# Altium project stm32辉光钟.PrjPcb
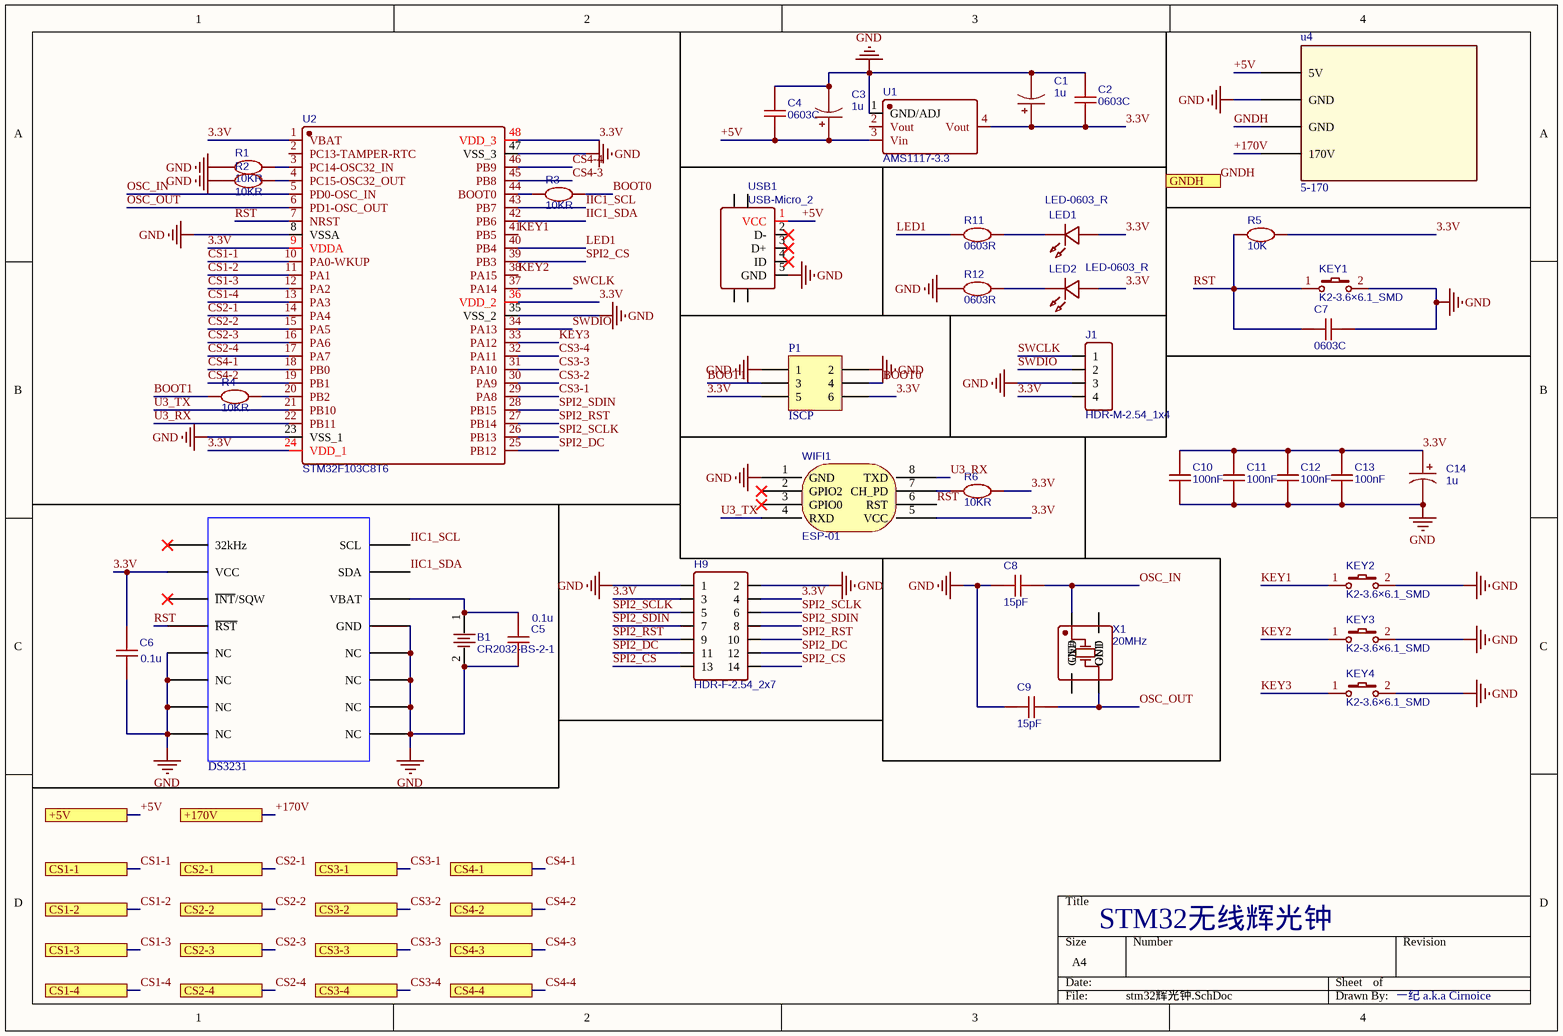
[diagram p0: stm32辉光钟.SchDoc]
2 sheets, 51 parts. Net scope: flat (ports and power ports of the same name join across sheets).
Board file: 辉光钟.PcbDoc
Sheets:
  stm32辉光钟.SchDoc
  辉光管驱动.SchDoc

## Sheet stm32辉光钟.SchDoc
size A4; SheetNumber: 2; SheetTotal: 3

### Parts
B1  CR2032-BS-2-1  [BAT-TH_BS-2-1]
C1  1u  [CASE-A_3216]
C2  0603C  [C0603]
C3  1u  [CASE-A_3216]
C4  0603C  [C0603]
C5  0.1u  [C0603]
C6  0.1u  [C0603]
C7  0603C  [C0603]
C8  15pF  [C0603]
C9  15pF  [C0603]
C10  100nF  [C0603]
C11  100nF  [C0603]
C12  100nF  [C0603]
C13  100nF  [C0603]
C14  1u  [CASE-A_3216]
ds1  DS3231  [DS3231]
H9  HDR-F-2.54_2x7  [HDR-F-2.54_2X7]
J1  HDR-M-2.54_1x4  [HDR-M-2.54_1X4]
KEY1  K2-3.6×6.1_SMD  [KEY-SMD_2P-L6.2-W3.6-LS8.0]
KEY2  K2-3.6×6.1_SMD  [KEY-SMD_2P-L6.2-W3.6-LS8.0]
KEY3  K2-3.6×6.1_SMD  [KEY-SMD_2P-L6.2-W3.6-LS8.0]
KEY4  K2-3.6×6.1_SMD  [KEY-SMD_2P-L6.2-W3.6-LS8.0]
LED1  LED-0603_R  [LED0603_RED]
LED2  LED-0603_R  [LED0603_RED]
P1  ISCP  [HDR2X3]
R1  10KR  [R0603]
R2  10KR  [R0603]
R3  10KR  [R0603]
R4  10KR  [R0603]
R5  10K  [R0603]
R6  10KR  [R0603]
R11  0603R  [R0603]
R12  0603R  [R0603]
U1  AMS1117-3.3  [SOT-223-3_L6.5-W3.4-P2.30-LS7.0-BR]
U2  STM32F103C8T6  [LQFP-48_L7.0-W7.0-P0.50-LS9.0-BL]
u4  5-170  [5-170V]
USB1  USB-Micro_2  [MICRO-USB-SMD_5P_C40957]
WIFI1  ESP-01  [ESP-01]
X1  20MHz  [CRYSTAL-SMD_4P-L3.2-W2.5-BL]

### Ports
+5V, +170V, CS1-1, CS1-2, CS1-3, CS1-4, CS2-1, CS2-2, CS2-3, CS2-4, CS3-1, CS3-2, CS3-3, CS3-4, CS4-1, CS4-2, CS4-3, CS4-4, GNDH

### Nets
GND: B1.2 C1.2 C2.2 C3.2 C4.2 C5.1 C6.1 C7.2 C8.1 C9.1 C10.1 C11.1 C12.1 C13.1 C14.2 ds1.5(NC) ds1.6(NC) ds1.7(NC) ds1.8(NC) ds1.9(NC) ds1.10(NC) ds1.11(NC) ds1.12(NC) ds1.13(GND) H9.1 H9.2 J1.3 KEY1.2 KEY2.2 KEY3.2 KEY4.2 P1.1 P1.2 R1.1 R2.1 R12.1 U1.1(GND/ADJ) U2.8(VSSA) U2.23(VSS_1) U2.35(VSS_2) U2.47(VSS_3) u4.2(GND) USB1.5(GND) WIFI1.1(GND)
3.3V: C1.1 C2.1 C6.2 C10.2 C11.2 C12.2 C13.2 C14.1 ds1.2(VCC) H9.3 H9.4 J1.4 LED1.1 LED2.1 P1.5 P1.6 R5.2 R6.2 U1.4(Vout) U2.1(VBAT) U2.9(VDDA) U2.24(VDD_1) U2.36(VDD_2) U2.48(VDD_3) WIFI1.5(VCC)
+5V: C3.1 C4.1 U1.3(Vin) u4.1(5V) USB1.1(VCC) ; port +5V
+170V: u4.4(170V) ; port +170V
BOOT0: P1.4 R3.2
BOOT1: P1.3 R4.1
CS1-1: U2.10(PA0-WKUP) ; port CS1-1
CS1-2: U2.11(PA1) ; port CS1-2
CS1-3: U2.12(PA2) ; port CS1-3
CS1-4: U2.13(PA3) ; port CS1-4
CS2-1: U2.14(PA4) ; port CS2-1
CS2-2: U2.15(PA5) ; port CS2-2
CS2-3: U2.16(PA6) ; port CS2-3
CS2-4: U2.17(PA7) ; port CS2-4
CS3-1: U2.29(PA8) ; port CS3-1
CS3-2: U2.30(PA9) ; port CS3-2
CS3-3: U2.31(PA10) ; port CS3-3
CS3-4: U2.32(PA11) ; port CS3-4
CS4-1: U2.18(PB0) ; port CS4-1
CS4-2: U2.19(PB1) ; port CS4-2
CS4-3: U2.45(PB8) ; port CS4-3
CS4-4: U2.46(PB9) ; port CS4-4
GNDH: u4.3(GND) ; port GNDH
IIC1_SCL: ds1.16(SCL) U2.43(PB7)
IIC1_SDA: ds1.15(SDA) U2.42(PB6)
KEY1: KEY2.1 U2.41(PB5)
KEY2: KEY3.1 U2.38(PA15)
KEY3: KEY4.1 U2.33(PA12)
LED1: R11.1 U2.40(PB4)
OSC_IN: C8.2 U2.5(PD0-OSC_IN) X1.1(OE#)
OSC_OUT: C9.2 U2.6(PD1-OSC_OUT) X1.3(OUT)
RST: C7.1 ds1.4(~{RST}) KEY1.1 R5.1 U2.7(NRST) WIFI1.6(RST)
SPI2_CS: H9.13 H9.14 U2.39(PB3)
SPI2_DC: H9.11 H9.12 U2.25(PB12)
SPI2_RST: H9.9 H9.10 U2.27(PB14)
SPI2_SCLK: H9.5 H9.6 U2.26(PB13)
SPI2_SDIN: H9.7 H9.8 U2.28(PB15)
SWCLK: J1.1 U2.37(PA14)
SWDIO: J1.2 U2.34(PA13)
U3_RX: U2.22(PB11) WIFI1.8(TXD)
U3_TX: U2.21(PB10) WIFI1.4(RXD)
NetB1_1: B1.1 C5.2 ds1.14(VBAT)
NetLED1_2: LED1.2 R11.2
NetLED2_2: LED2.2 R12.2
NetR1_2: R1.2 U2.3(PC14-OSC32_IN)
NetR2_2: R2.2 U2.4(PC15-OSC32_OUT)
NetR3_1: R3.1 U2.44(BOOT0)
NetR4_2: R4.2 U2.20(PB2)
NetR6_1: R6.1 WIFI1.7(CH_PD)

Not connected (* = marked no-connect by the designer): ds1 1(32kHz)* 3(~{INT}/SQW)*; U1 2(Vout); U2 2(PC13-TAMPER-RTC); USB1 2(D-)* 3(D+)* 4(ID)* 6(SH3) 7(SH4) 8(SH1) 9(SH2); WIFI1 2(GPIO2)* 3(GPIO0)*; X1 2(GND) 4(GND)

### Notes on the sheet
- STM32无线辉光钟
- 一纪 a.k.a Cirnoice

### Library data of the parts
B1 = CR2032-BS-2-1: BOM_Manufacturer: Q&J; BOM_Manufacturer Part: BS-2-1; BOM_Supplier: LCSC; BOM_Supplier Part: C70376; BOM_JLCPCB Part Class: Extended Part; spicePre: B; spiceSymbolName: CR2032-BS-2-1
C1 C3 C14 = 1u: nameAlias: Value(F); Contributor: LCEDA_Lib; spicePre: C; spiceSymbolName: C_Tan_SMD_A_US
C2 C4-C13 = 0603C: nameAlias: Value(F); Contributor: LCEDA_Lib; spicePre: C; spiceSymbolName: C_0603_US
H9 = HDR-F-2.54_2x7: Contributor: LCEDA_Lib; BOM_Supplier Part: C38844; BOM_Supplier: LCSC; spicePre: H; spiceSymbolName: HDR-F-2.54_2x7
J1 = HDR-M-2.54_1x4: Contributor: LCEDA_Lib; BOM_Supplier Part: C124378; BOM_Supplier: LCSC; spicePre: J; spiceSymbolName: HDR-M-2.54_1x4
KEY1-KEY4 = K2-3.6×6.1_SMD: BOM_Manufacturer Part: K2-1107ST-A4SW-06; Contributor: LCEDA_Lib; 制造商: 韩国韩荣; BOM_Supplier Part: C118141; BOM_Supplier: LCSC; spicePre: K; spiceSymbolName: K2-3.6×6.1_SMD
LED1 LED2 = LED-0603_R: BOM_Manufacturer: EVERLIGHT(台湾亿光); BOM_Manufacturer Part: 19-217/R6C-AL1M2VY/3T; Contributor: LCEDA_01; BOM_Supplier Part: C72044; BOM_Supplier: LCSC; spicePre: L; spiceSymbolName: LED-0603_R
P1 = Header 3X2: Header, 3-Pin, Dual row; LatestRevisionDate: 17-Jul-2002; LatestRevisionNote: Re-released for DXP Platform.; Publisher: Altium Limited
R1-R6 R11 R12 = 0603R: nameAlias: Value(Ω); Contributor: LCEDA_Lib; spicePre: R; spiceSymbolName: R_0603_EU
U1 = AMS1117-3.3: BOM_Manufacturer: AMS; sourceId: dwIGgezVh; timeStamp: 1476261164; BOM_Supplier: LCSC; BOM_Manufacturer Part: AMS1117-3.3; BOM_Supplier Part: C6186; BOM_JLCPCB Part Class: Basic Part; spicePre: U; spiceSymbolName: AMS1117-3.3
U2 = STM32F103C8T6: BOM_Manufacturer: STMicroelectronics; timeStamp: 1455028086; BOM_Supplier: LCSC; BOM_Manufacturer Part: STM32F103C8T6; BOM_Supplier Part: C8734; BOM_JLCPCB Part Class: Basic Part; spicePre: U; spiceSymbolName: STM32F103C8T6
USB1 = USB-Micro_2: BOM_Manufacturer: ValuePro; Contributor: LCEDA_Lib; BOM_Supplier Part: C40957; BOM_Supplier: LCSC; spicePre: U; spiceSymbolName: USB-Micro_2
WIFI1 = ESP-01: Contributor: jishuhai; spicePre: w; spiceSymbolName: ESP-01
X1 = 20MHz: BOM_Manufacturer: Zhejiang Abel Elec; BOM_Manufacturer Part: SMD-3225_4P20MHZ20PF10PPM; nameAlias: Frequency; Contributor: LCSC; BOM_Supplier: LCSC; BOM_Supplier Part: C172730; BOM_JLCPCB Part Class: Extended Part; spicePre: X; spiceSymbolName: SMD-3225_4P20MHZ20PF10PPM

## Sheet 辉光管驱动.SchDoc
size A4; SheetNumber: 3; SheetTotal: 3
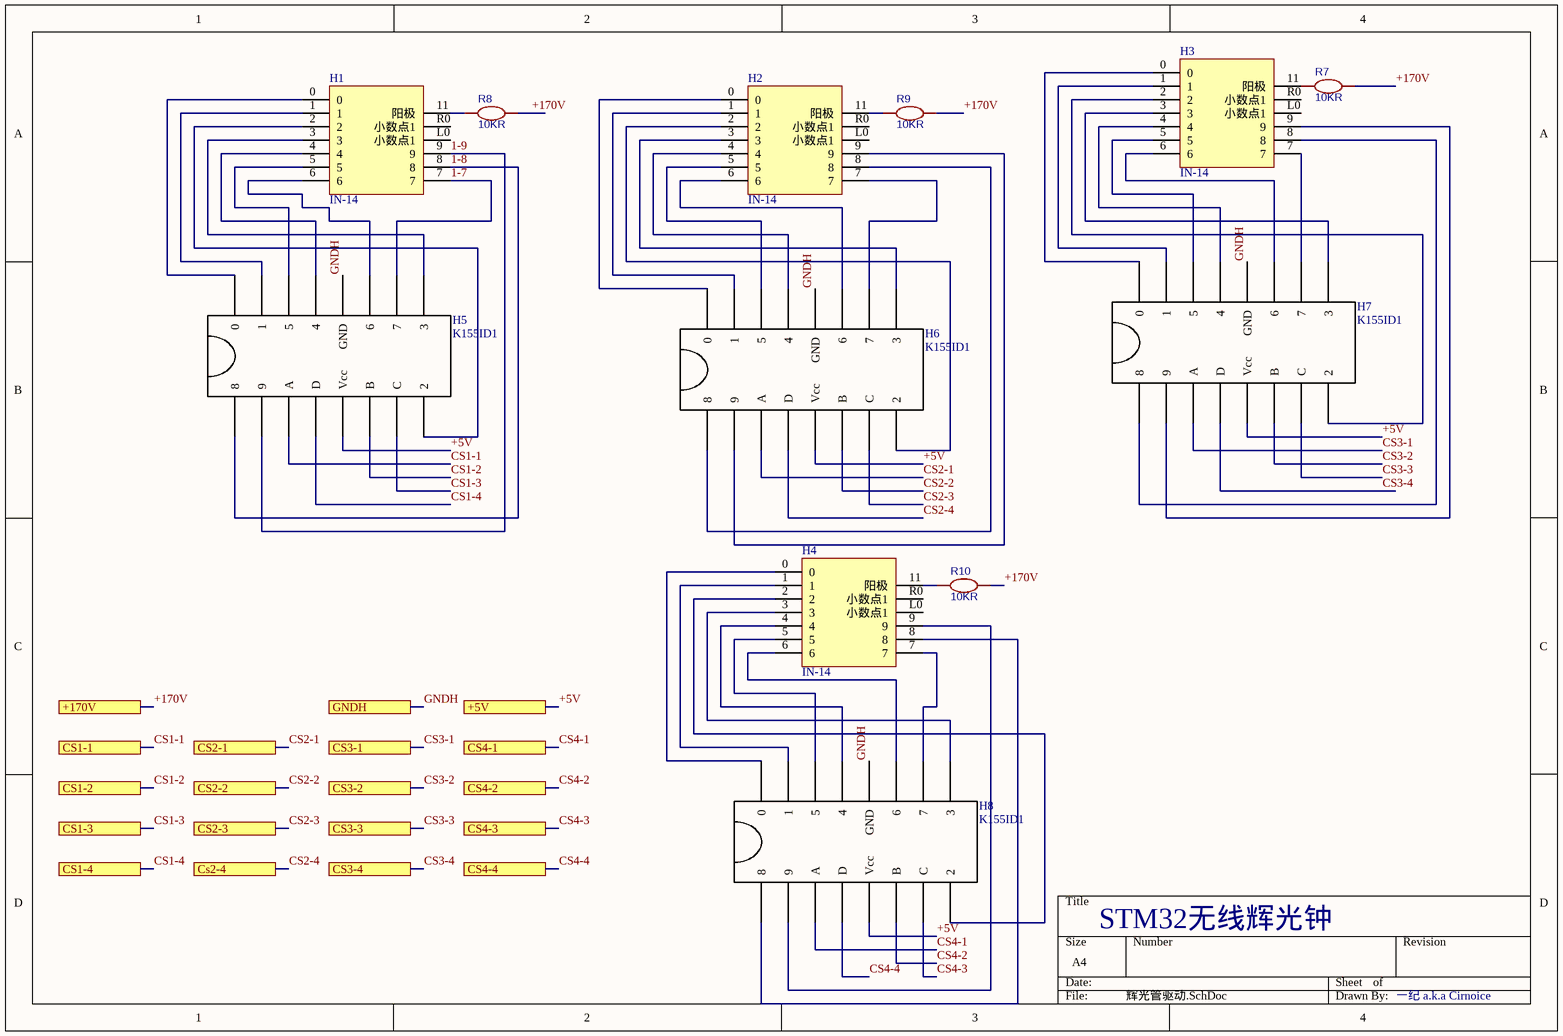
[diagram p1: 辉光管驱动.SchDoc]

### Parts
H1  IN-14  [IN-14]
H2  IN-14  [IN-14]
H3  IN-14  [IN-14]
H4  IN-14  [IN-14]
H5  K155ID1  [DIP-16]
H6  K155ID1  [DIP-16]
H7  K155ID1  [DIP-16]
H8  K155ID1  [DIP-16]
R7  10KR  [R0603]
R8  10KR  [R0603]
R9  10KR  [R0603]
R10  10KR  [R0603]

### Ports
+5V, +170V, CS1-1, CS1-2, CS1-3, CS1-4, CS2-1, CS2-2, CS2-3, Cs2-4, CS3-1, CS3-2, CS3-3, CS3-4, CS4-1, CS4-2, CS4-3, CS4-4, GNDH

### Nets
1-7: H1.7 H5.10(7)
1-8: H1.8 H5.1(8)
1-9: H1.9 H5.2(9)
+5V: H5.5(Vcc) H6.5(Vcc) H7.5(Vcc) H8.5(Vcc) ; port +5V
+170V: R7.2 R8.2 R9.2 R10.2 ; port +170V
CS1-1: H5.3(A) ; port CS1-1
CS1-2: H5.6(B) ; port CS1-2
CS1-3: H5.7(C) ; port CS1-3
CS1-4: H5.4(D) ; port CS1-4
CS2-1: H6.3(A) ; port CS2-1
CS2-2: H6.6(B) ; port CS2-2
CS2-3: H6.7(C) ; port CS2-3
CS2-4: H6.4(D) ; port Cs2-4
CS3-1: H7.3(A) ; port CS3-1
CS3-2: H7.6(B) ; port CS3-2
CS3-3: H7.7(C) ; port CS3-3
CS3-4: H7.4(D) ; port CS3-4
CS4-1: H8.3(A) ; port CS4-1
CS4-2: H8.6(B) ; port CS4-2
CS4-3: H8.7(C) ; port CS4-3
CS4-4: H8.4(D) ; port CS4-4
GNDH: H5.12(GND) H6.12(GND) H7.12(GND) H8.12(GND) ; port GNDH
NetH1_0: H1.0 H5.16(0)
NetH1_1: H1.1 H5.15(1)
NetH1_2: H1.2 H5.8(2)
NetH1_3: H1.3 H5.9(3)
NetH1_4: H1.4 H5.13(4)
NetH1_5: H1.5 H5.14(5)
NetH1_6: H1.6 H5.11(6)
NetH1_11: H1.11(阳极) R8.1
NetH2_0: H2.0 H6.16(0)
NetH2_1: H2.1 H6.15(1)
NetH2_2: H2.2 H6.8(2)
NetH2_3: H2.3 H6.9(3)
NetH2_4: H2.4 H6.13(4)
NetH2_5: H2.5 H6.14(5)
NetH2_6: H2.6 H6.11(6)
NetH2_7: H2.7 H6.10(7)
NetH2_8: H2.8 H6.1(8)
NetH2_9: H2.9 H6.2(9)
NetH2_11: H2.11(阳极) R9.1
NetH3_0: H3.0 H7.16(0)
NetH3_1: H3.1 H7.15(1)
NetH3_2: H3.2 H7.8(2)
NetH3_3: H3.3 H7.9(3)
NetH3_4: H3.4 H7.13(4)
NetH3_5: H3.5 H7.14(5)
NetH3_6: H3.6 H7.11(6)
NetH3_7: H3.7 H7.10(7)
NetH3_8: H3.8 H7.1(8)
NetH3_9: H3.9 H7.2(9)
NetH3_11: H3.11(阳极) R7.1
NetH4_0: H4.0 H8.16(0)
NetH4_1: H4.1 H8.15(1)
NetH4_2: H4.2 H8.8(2)
NetH4_3: H4.3 H8.9(3)
NetH4_4: H4.4 H8.13(4)
NetH4_5: H4.5 H8.14(5)
NetH4_6: H4.6 H8.11(6)
NetH4_7: H4.7 H8.10(7)
NetH4_8: H4.8 H8.1(8)
NetH4_9: H4.9 H8.2(9)
NetH4_11: H4.11(阳极) R10.1

Not connected (* = marked no-connect by the designer): H1 L0(小数点1) R0(小数点1); H2 L0(小数点1) R0(小数点1); H3 L0(小数点1) R0(小数点1); H4 L0(小数点1) R0(小数点1)

### Notes on the sheet
- STM32无线辉光钟
- 一纪 a.k.a Cirnoice

### Library data of the parts
R7-R10 = 0603R: as R1 on sheet stm32辉光钟; spicePre: R; spiceSymbolName: R_0603_EU

## Nets that join several sheets
+5V: stm32辉光钟 (5 pins), 辉光管驱动 (H5.5 H6.5 H7.5 H8.5)
+170V: stm32辉光钟 (u4.4), 辉光管驱动 (R7.2 R8.2 R9.2 R10.2)
CS1-1: stm32辉光钟 (U2.10), 辉光管驱动 (H5.3)
CS1-2: stm32辉光钟 (U2.11), 辉光管驱动 (H5.6)
CS1-3: stm32辉光钟 (U2.12), 辉光管驱动 (H5.7)
CS1-4: stm32辉光钟 (U2.13), 辉光管驱动 (H5.4)
CS2-1: stm32辉光钟 (U2.14), 辉光管驱动 (H6.3)
CS2-2: stm32辉光钟 (U2.15), 辉光管驱动 (H6.6)
CS2-3: stm32辉光钟 (U2.16), 辉光管驱动 (H6.7)
CS2-4: stm32辉光钟 (U2.17), 辉光管驱动 (H6.4)
CS3-1: stm32辉光钟 (U2.29), 辉光管驱动 (H7.3)
CS3-2: stm32辉光钟 (U2.30), 辉光管驱动 (H7.6)
CS3-3: stm32辉光钟 (U2.31), 辉光管驱动 (H7.7)
CS3-4: stm32辉光钟 (U2.32), 辉光管驱动 (H7.4)
CS4-1: stm32辉光钟 (U2.18), 辉光管驱动 (H8.3)
CS4-2: stm32辉光钟 (U2.19), 辉光管驱动 (H8.6)
CS4-3: stm32辉光钟 (U2.45), 辉光管驱动 (H8.7)
CS4-4: stm32辉光钟 (U2.46), 辉光管驱动 (H8.4)
GNDH: stm32辉光钟 (u4.3), 辉光管驱动 (H5.12 H6.12 H7.12 H8.12)